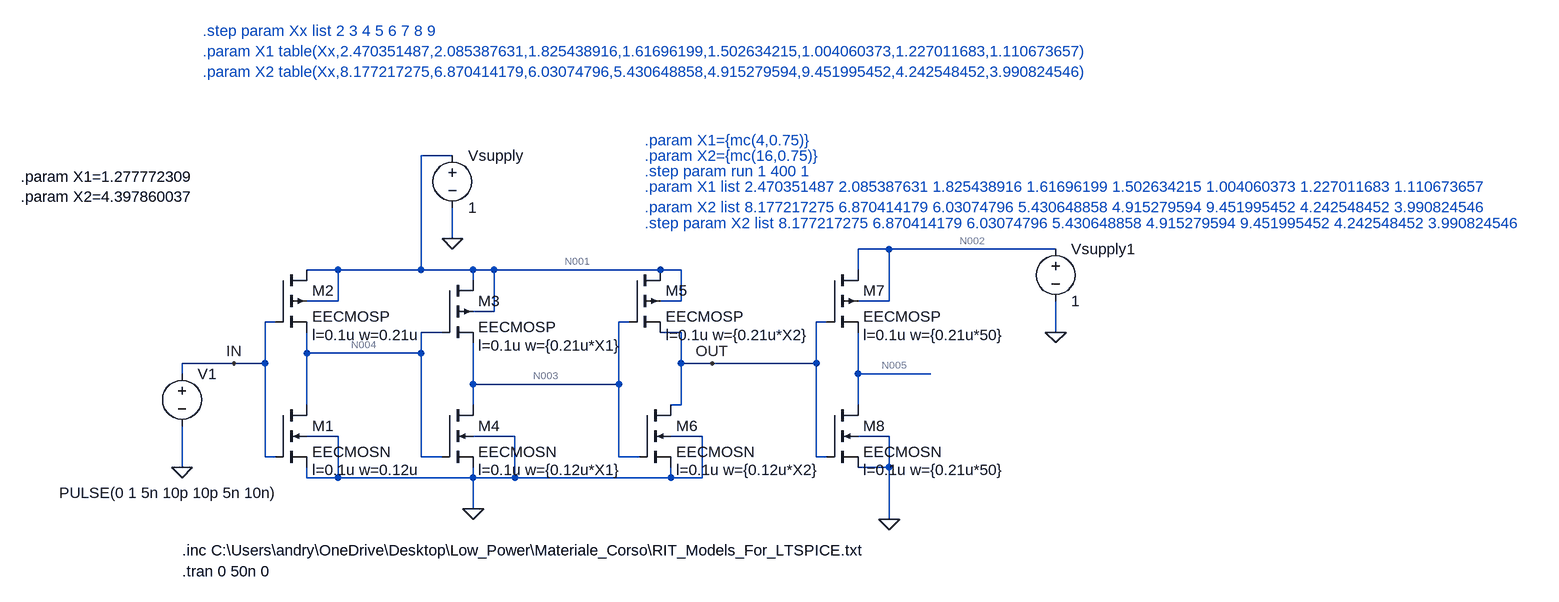
[diagram p0: schematic Esercitazione_3_2.asc]
Esercitazione_3_2.asc, the LTspice schematic file:
Version 4
SHEET 1 2612 680
WIRE 480 -192 432 -192
WIRE 480 -64 480 -112
WIRE 1152 -48 1104 -48
WIRE 1408 -48 1152 -48
WIRE 304 -16 256 -16
WIRE 432 -16 432 -192
WIRE 432 -16 304 -16
WIRE 512 -16 432 -16
WIRE 544 -16 512 -16
WIRE 800 -16 544 -16
WIRE 832 -16 800 -16
WIRE 1104 -16 1104 -48
WIRE 512 0 512 -16
WIRE 304 32 304 -16
WIRE 304 32 256 32
WIRE 832 32 832 -16
WIRE 832 32 800 32
WIRE 1152 32 1152 -48
WIRE 1152 32 1104 32
WIRE 544 48 544 -16
WIRE 544 48 512 48
WIRE 208 64 192 64
WIRE 752 64 736 64
WIRE 1056 64 1040 64
WIRE 464 80 432 80
WIRE 832 80 800 80
WIRE 1408 80 1408 32
WIRE 256 112 256 80
WIRE 432 112 432 80
WIRE 432 112 256 112
WIRE 144 128 64 128
WIRE 192 128 192 64
WIRE 192 128 144 128
WIRE 832 128 832 80
WIRE 880 128 832 128
WIRE 1040 128 1040 64
WIRE 1040 128 880 128
WIRE 64 144 64 128
WIRE 1104 144 1104 80
WIRE 1216 144 1104 144
WIRE 512 160 512 96
WIRE 736 160 736 64
WIRE 736 160 512 160
WIRE 256 192 256 112
WIRE 512 192 512 160
WIRE 832 192 832 128
WIRE 832 192 816 192
WIRE 1104 192 1104 144
WIRE 304 240 256 240
WIRE 576 240 512 240
WIRE 864 240 816 240
WIRE 1152 240 1104 240
WIRE 192 272 192 128
WIRE 208 272 192 272
WIRE 432 272 432 112
WIRE 464 272 432 272
WIRE 736 272 736 160
WIRE 768 272 736 272
WIRE 1040 272 1040 128
WIRE 1056 272 1040 272
WIRE 64 288 64 224
WIRE 1152 288 1152 240
WIRE 1152 288 1104 288
WIRE 256 304 256 288
WIRE 304 304 304 240
WIRE 304 304 256 304
WIRE 512 304 512 288
WIRE 512 304 304 304
WIRE 576 304 576 240
WIRE 576 304 512 304
WIRE 816 304 816 288
WIRE 816 304 576 304
WIRE 864 304 864 240
WIRE 864 304 816 304
WIRE 512 352 512 304
WIRE 1152 368 1152 288
FLAG 64 288 0
FLAG 512 352 0
FLAG 1152 368 0
FLAG 480 -64 0
FLAG 1408 80 0
FLAG 144 128 IN
FLAG 880 128 OUT
SYMBOL voltage 64 128 R0
WINDOW 3 -189 199 Left 2
WINDOW 123 0 0 Left 0
WINDOW 39 0 0 Left 0
SYMATTR Value PULSE(0 1 5n 10p 10p 5n 10n)
SYMATTR InstName V1
SYMBOL nmos4 208 192 R0
WINDOW 123 56 100 Left 2
SYMATTR Value2 l=0.1u w=0.12u
SYMATTR InstName M1
SYMATTR Value EECMOSN
SYMBOL pmos4 208 -16 R0
WINDOW 123 56 100 Left 2
SYMATTR Value2 l=0.1u w=0.21u
SYMATTR InstName M2
SYMATTR Value EECMOSP
SYMBOL pmos4 464 0 R0
WINDOW 123 56 100 Left 2
SYMATTR Value2 l=0.1u w={0.21u*X1}
SYMATTR InstName M3
SYMATTR Value EECMOSP
SYMBOL nmos4 464 192 R0
WINDOW 123 56 100 Left 2
SYMATTR Value2 l=0.1u w={0.12u*X1}
SYMATTR InstName M4
SYMATTR Value EECMOSN
SYMBOL pmos4 752 -16 R0
WINDOW 123 56 100 Left 2
SYMATTR Value2 l=0.1u w={0.21u*X2}
SYMATTR InstName M5
SYMATTR Value EECMOSP
SYMBOL nmos4 768 192 R0
WINDOW 123 56 100 Left 2
SYMATTR Value2 l=0.1u w={0.12u*X2}
SYMATTR InstName M6
SYMATTR Value EECMOSN
SYMBOL pmos4 1056 -16 R0
WINDOW 123 56 100 Left 2
SYMATTR Value2 l=0.1u w={0.21u*50}
SYMATTR InstName M7
SYMATTR Value EECMOSP
SYMBOL nmos4 1056 192 R0
WINDOW 123 56 100 Left 2
SYMATTR Value2 l=0.1u w={0.21u*50}
SYMATTR InstName M8
SYMATTR Value EECMOSN
SYMBOL voltage 480 -208 R0
WINDOW 123 0 0 Left 0
WINDOW 39 0 0 Left 0
SYMATTR InstName Vsupply
SYMATTR Value 1
SYMBOL voltage 1408 -64 R0
WINDOW 123 0 0 Left 0
WINDOW 39 0 0 Left 0
SYMATTR InstName Vsupply1
SYMATTR Value 1
TEXT 64 416 Left 2 !.inc C:\\Users\\andry\\OneDrive\\Desktop\\Low_Power\\Materiale_Corso\\RIT_Models_For_LTSPICE.txt
TEXT 64 448 Left 2 !.tran 0 50n 0
TEXT 776 -216 Left 2 ;.param X1={mc(4,0.75)}
TEXT 776 -192 Left 2 ;.param X2={mc(16,0.75)}
TEXT 776 -168 Left 2 ;.step param run 1 400 1
TEXT 776 -144 Left 2 ;.param X1 list 2.470351487 2.085387631 1.825438916 1.61696199 1.502634215 1.004060373 1.227011683 1.110673657\n.param X2 list 8.177217275 6.870414179 6.03074796 5.430648858 4.915279594 9.451995452 4.242548452 3.990824546
TEXT 776 -88 Left 2 ;.step param X2 list 8.177217275 6.870414179 6.03074796 5.430648858 4.915279594 9.451995452 4.242548452 3.990824546
TEXT 96 -384 Left 2 ;.step param Xx list 2 3 4 5 6 7 8 9\n.param X1 table(Xx,2.470351487,2.085387631,1.825438916,1.61696199,1.502634215,1.004060373,1.227011683,1.110673657)\n.param X2 table(Xx,8.177217275,6.870414179,6.03074796,5.430648858,4.915279594,9.451995452,4.242548452,3.990824546)
TEXT -184 -160 Left 2 !.param X1=1.277772309\n.param X2=4.397860037

The netlist it stands for:
* Esercitazione_3_2.asc
V1 IN 0 PULSE(0 1 5n 10p 10p 5n 10n)
M1 N004 IN 0 0 EECMOSN l=0.1u w=0.12u
M2 N001 IN N004 N001 EECMOSP l=0.1u w=0.21u
M3 N001 N004 N003 N001 EECMOSP l=0.1u w={0.21u*X1}
M4 N003 N004 0 0 EECMOSN l=0.1u w={0.12u*X1}
M5 N001 N003 OUT N001 EECMOSP l=0.1u w={0.21u*X2}
M6 OUT N003 0 0 EECMOSN l=0.1u w={0.12u*X2}
M7 N002 OUT N005 N002 EECMOSP l=0.1u w={0.21u*50}
M8 N005 OUT 0 0 EECMOSN l=0.1u w={0.21u*50}
Vsupply N001 0 1
Vsupply1 N002 0 1
.model NMOS NMOS
.model PMOS PMOS
.lib standard.mos
.inc C:\Users\andry\OneDrive\Desktop\Low_Power\Materiale_Corso\RIT_Models_For_LTSPICE.txt
.tran 0 50n 0
* .param X1={mc(4,0.75)}
* .param X2={mc(16,0.75)}
* .step param run 1 400 1
* .param X1 list 2.470351487 2.085387631 1.825438916 1.61696199 1.502634215 1.004060373 1.227011683 1.110673657
* .param X2 list 8.177217275 6.870414179 6.03074796 5.430648858 4.915279594 9.451995452 4.242548452 3.990824546
* .step param X2 list 8.177217275 6.870414179 6.03074796 5.430648858 4.915279594 9.451995452 4.242548452 3.990824546
* .step param Xx list 2 3 4 5 6 7 8 9
* .param X1 table(Xx,2.470351487,2.085387631,1.825438916,1.61696199,1.502634215,1.004060373,1.227011683,1.110673657)
* .param X2 table(Xx,8.177217275,6.870414179,6.03074796,5.430648858,4.915279594,9.451995452,4.242548452,3.990824546)
.param X1=1.277772309
.param X2=4.397860037
.backanno
.end

* Results of the author's LTspice run, read from the files saved beside the schematic
* Operating Point, zero values left out:
*   V(n004) = 999.9 mV
*   V(n001) = 1 V
*   V(n003) = 69 µV
*   V(out) = 999.9 mV
*   V(n002) = 1 V
*   V(n005) = 505.8 µV
*   Id(M7) = 5.148 µA
*   Ib(M7) = 1.009 pA
*   Is(M7) = -5.148 µA
*   Id(M5) = 56.9 nA
*   Is(M5) = -56.9 nA
*   Id(M3) = 7.68 nA
*   Ib(M3) = 1.01 pA
*   Is(M3) = -7.681 nA
*   Id(M2) = 6.593 nA
*   Is(M2) = -6.593 nA
*   Id(M8) = 5.148 µA
*   Is(M8) = -5.148 µA
*   Id(M6) = 56.9 nA
*   Ib(M6) = -1.01 pA
*   Is(M6) = -56.9 nA
*   Id(M4) = 7.681 nA
*   Is(M4) = -7.681 nA
*   Id(M1) = 6.593 nA
*   Ib(M1) = -1.01 pA
*   Is(M1) = -6.592 nA
*   I(Vsupply1) = -5.148 µA
*   I(Vsupply) = -71.17 nA
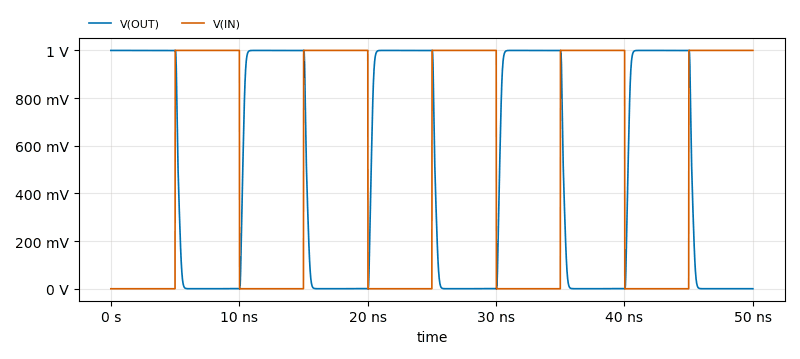
[diagram p1: Transient Analysis of Esercitazione_3_2.asc, plotted from the saved traces]
* Transient Analysis, 1 run:
*   V(OUT): min -239 µV, max 1 V, average 504.5 mV, rms 699.7 mV, last 129.9 µV
*   V(IN): min 0 V, max 1 V, average 500.7 mV, rms 707.4 mV, last 1 V